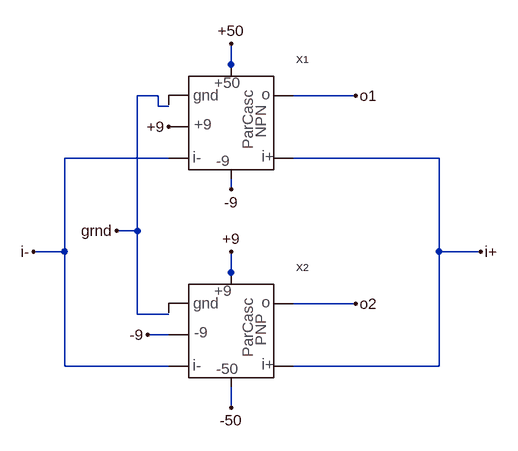
[diagram p0: schematic ss-doble-par-cascode.asc]
ss-doble-par-cascode.asc, the LTspice schematic file:
Version 4
SHEET 1 940 680
WIRE 128 -160 128 -192
WIRE 128 -144 128 -160
WIRE 16 -112 -16 -112
WIRE 320 -112 224 -112
WIRE 16 -96 16 -112
WIRE 32 -96 16 -96
WIRE 32 -16 -128 -16
WIRE 448 -16 224 -16
WIRE 128 32 128 16
WIRE -16 96 -16 -112
WIRE -16 96 -48 96
WIRE -128 128 -128 -16
WIRE -128 128 -176 128
WIRE 448 128 448 -16
WIRE 512 128 448 128
WIRE 128 160 128 128
WIRE 128 176 128 160
WIRE 320 208 224 208
WIRE -16 224 -16 96
WIRE 32 224 -16 224
WIRE 32 256 0 256
WIRE -128 304 -128 128
WIRE 32 304 -128 304
WIRE 448 304 448 128
WIRE 448 304 224 304
WIRE 128 368 128 336
FLAG 128 128 +9
FLAG 128 368 -50
FLAG 0 256 -9
FLAG 320 -112 o1
FLAG 320 208 o2
FLAG 128 32 -9
FLAG 128 -192 +50
FLAG 32 -64 +9
FLAG -176 128 i-
FLAG 512 128 i+
FLAG -48 96 grnd
SYMBOL ss-par-cascode-npn 128 -80 R0
SYMATTR InstName X1
SYMBOL ss-par-cascode-pnp 128 240 R0
SYMATTR InstName X2

The netlist it stands for:
* ss-doble-par-cascode.asc
XX1 i- i+ o1 +50 -9 grnd +9 ss-par-cascode-npn  ; pins i- i+ o +50 -9 grnd +9
XX2 i- i+ o2 +9 -50 grnd -9 ss-par-cascode-pnp  ; pins i- i+ o +9 -50 grnd -9
.backanno
.end